# Altium schematic sheet Pwr.SchDoc
size A4; SheetNumber: 4; SheetTotal: 6
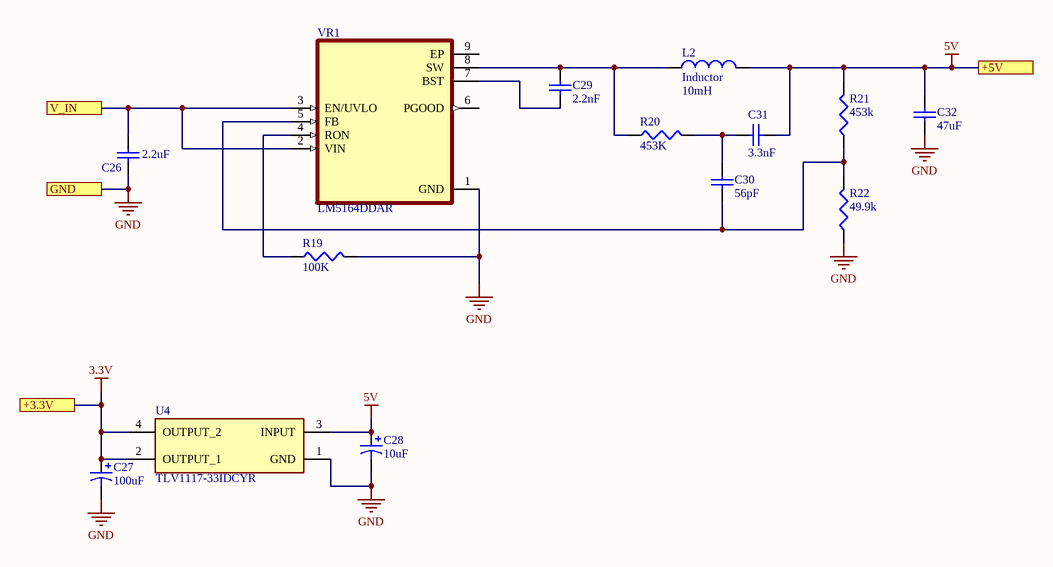
[diagram p0: Pwr.SchDoc]

## Parts
C26  value 2.2uF  [C0805]  (hidden comment: Cap)
C27  value 100uF  [CAPAE660X800N]  (hidden comment: Cap Pol3)
C28  value 10uF  [CAPAE660X800N]  (hidden comment: Cap Pol3)
C29  value 2.2nF  [C0805]  (hidden comment: Cap)
C30  value 56pF  [C0805]  (hidden comment: Cap)
C31  value 3.3nF  [C0805]  (hidden comment: Cap)
C32  value 47uF  [C0805]  (hidden comment: Cap)
L2  Inductor  value 10mH  [0402-A]
R19  value 100K  [J1-0603]  (hidden comment: Res3)
R20  value 453K  [J1-0603]  (hidden comment: Res3)
R21  value 453k  [J1-0603]  (hidden comment: Res3)
R22  value 49.9k  [J1-0603]  (hidden comment: Res3)
U4  TLV1117-33IDCYR  [SOT230P700X180-4N]
VR1  LM5164DDAR  [VREG_LM5017MR/NOPB]

## Ports
+3.3V, +5V, GND, V_IN

## Nets
3.3V: C27.1 U4.2(OUTPUT_1) U4.4(OUTPUT_2) ; port +3.3V
5V: C28.1 C31.1 C32.1 L2.2 R21.2 U4.3(INPUT) ; port +5V
GND: C26.2 C27.2 C28.2 C32.2 R19.2 R22.1 U4.1(GND) VR1.1(GND) ; port GND
V_IN: C26.1 VR1.2(VIN) VR1.3(EN/UVLO) ; port V_IN
NetC29_1: C29.1 VR1.7(BST)
NetC29_2: C29.2 L2.1 R20.1 VR1.8(SW)
NetC30_1: C30.1 C31.2 R20.2
NetC30_2: C30.2 R21.1 R22.2 VR1.5(FB)
NetR19_1: R19.1 VR1.4(RON)

Not connected (* = marked no-connect by the designer): VR1 6(PGOOD) 9(EP)

## Library data of the parts
C26 C29-C32 = Cap: Capacitor; Published: 8-Jun-2000; LatestRevisionDate: 17-Jul-2002; LatestRevisionNote: Re-released for DXP Platform.; PackageReference: RAD-0.3; Publisher: Altium Limited; PackageDescription: Radial Cap, Thru-Hole; 2 Leads; 0.3 in Pin Spacing
C27 C28 = Cap Pol3: Polarized Capacitor (Surface Mount); Published: 8-Jun-2000; LatestRevisionDate: 29-May-2009; LatestRevisionNote: IPC-7351 Footprint Added.; PackageReference: C0805; Publisher: Altium Limited; PackageDescription: Chip Capacitor
L2 = Inductor: Code_IEC: 1005; Published: 8-Jun-2000; LatestRevisionDate: 29-May-2009; LatestRevisionNote: IPC-7351 Footprint Added.; PackageReference: 0402-A; Publisher: Altium Limited; PackageDescription: Chip Inductor; Code_JEITA: 0402
R19-R22 = Res3: Resistor; Published: 8-Jun-2000; LatestRevisionDate: 29-May-2009; LatestRevisionNote: IPC-7351 Footprint Added.; PackageReference: J1-0603; Publisher: Altium Limited; PackageDescription: Chip Resistor
U4 = TLV1117-33IDCYR: Integrated Circuit; Manufacturer_Name: Texas Instruments; Datasheet Link: http://www.ti.com/lit/ds/symlink/tlv1117.pdf?HQS=TI-null-null-digikeymode-df-pf-null-wwe&ts=1590668900314; Height: 1.8mm; Manufacturer_Part_Number: TLV1117-33IDCYR; Arrow Part Number: TLV1117-33IDCYR; Arrow Price/Stock: https://www.arrow.com/en/products/tlv1117-33idcyr/texas-instruments; Mouser Part Number: 595-TLV1117-33IDCYR; Mouser Price/Stock: https://www.mouser.co.uk/ProductDetail/Texas-Instruments/TLV1117-33IDCYR?qs=p6lVfQR1GSoKgp3tAXcW5w%3D%3D
VR1 = LM5164DDAR: 6-V to 100-V input, 1-A synchronous buck DC-DC converter with ultra-low IQ 8-SO PowerPAD -40 to 150; MF: Texas Instruments; Availability: Unavailable; Texas_Instruments-Purchase-URL: https://snapeda.com/shop?store=Texas+Instruments&id=3234860; SnapEDA_Link: https://www.snapeda.com/parts/LM5164DDAR/Texas%20Instruments/view-part/3234860/?ref=snap; Price: None; Package: HSOIC-8 Texas Instruments; Mouser-Purchase-URL: https://snapeda.com/shop?store=Mouser&id=3234860; MP: LM5164DDAR; Value: *